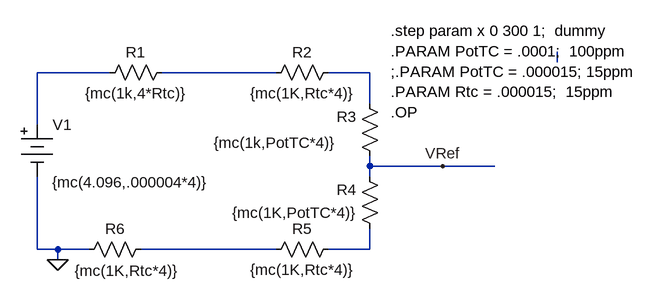
[diagram p0: schematic Vref.asc]
Vref.asc, the LTspice schematic file:
Version 4
SHEET 1 1164 680
WIRE 656 80 656 64
WIRE -32 96 -144 96
WIRE 224 96 48 96
WIRE 368 96 304 96
WIRE 368 144 368 96
WIRE -144 176 -144 96
WIRE 368 240 368 224
WIRE 480 240 368 240
WIRE 560 240 480 240
WIRE 368 256 368 240
WIRE -144 368 -144 256
WIRE -112 368 -144 368
WIRE -64 368 -112 368
WIRE 224 368 16 368
WIRE 368 368 368 336
WIRE 368 368 304 368
WIRE -112 384 -112 368
FLAG 480 240 VRef
FLAG -112 384 0
SYMBOL Res 64 80 R90
WINDOW 0 0 56 VBottom 2
WINDOW 3 32 56 VTop 2
WINDOW 123 54 56 VTop 2
SYMATTR InstName R1
SYMATTR Value {mc(1k,4*Rtc)}
SYMBOL Res 320 80 R90
WINDOW 0 0 56 VBottom 2
WINDOW 3 32 56 VTop 2
SYMATTR InstName R2
SYMATTR Value {mc(1K,Rtc*4)}
SYMBOL Res 384 240 R180
WINDOW 0 36 76 Left 2
WINDOW 3 68 36 Left 2
SYMATTR InstName R3
SYMATTR Value {mc(1k,PotTC*4)}
SYMBOL Res 384 352 R180
WINDOW 0 36 76 Left 2
WINDOW 3 36 40 Left 2
SYMATTR InstName R4
SYMATTR Value {mc(1K,PotTC*4)}
SYMBOL Res 208 384 R270
WINDOW 0 32 56 VTop 2
WINDOW 3 0 56 VBottom 2
WINDOW 123 -22 56 VBottom 2
SYMATTR InstName R5
SYMATTR Value {mc(1K,Rtc*4)}
SYMBOL Res -80 384 R270
WINDOW 0 32 56 VTop 2
WINDOW 3 -1 74 VBottom 2
SYMATTR InstName R6
SYMATTR Value {mc(1K,Rtc*4)}
SYMBOL Misc/battery -144 160 R0
WINDOW 3 23 105 Left 2
SYMATTR Value {mc(4.096,.000004*4)}
SYMATTR InstName V1
SYMATTR SpiceLine Rser=0.000002
TEXT 400 32 Left 2 !.step param x 0 300 1;  dummy\n.PARAM PotTC = .0001;  100ppm\n;.PARAM PotTC = .000015; 15ppm\n.PARAM Rtc = .000015;  15ppm\n.OP

The netlist it stands for:
* Vref.asc
R1 N003 N002 {mc(1k,4*Rtc)}
R2 N004 N003 {mc(1K,Rtc*4)}
R3 VRef N004 {mc(1k,PotTC*4)}
R4 N006 VRef {mc(1K,PotTC*4)}
R5 N005 N006 {mc(1K,Rtc*4)}
R6 0 N005 {mc(1K,Rtc*4)}
V1 N002 0 {mc(4.096,.000004*4)} Rser=0.000002
.step param x 0 300 1;  dummy
.PARAM PotTC = .0001;  100ppm
;.PARAM PotTC = .000015; 15ppm
.PARAM Rtc = .000015;  15ppm
.OP
.backanno
.end